# EAGLE design Keyboard (EAGLE 9.1.0)
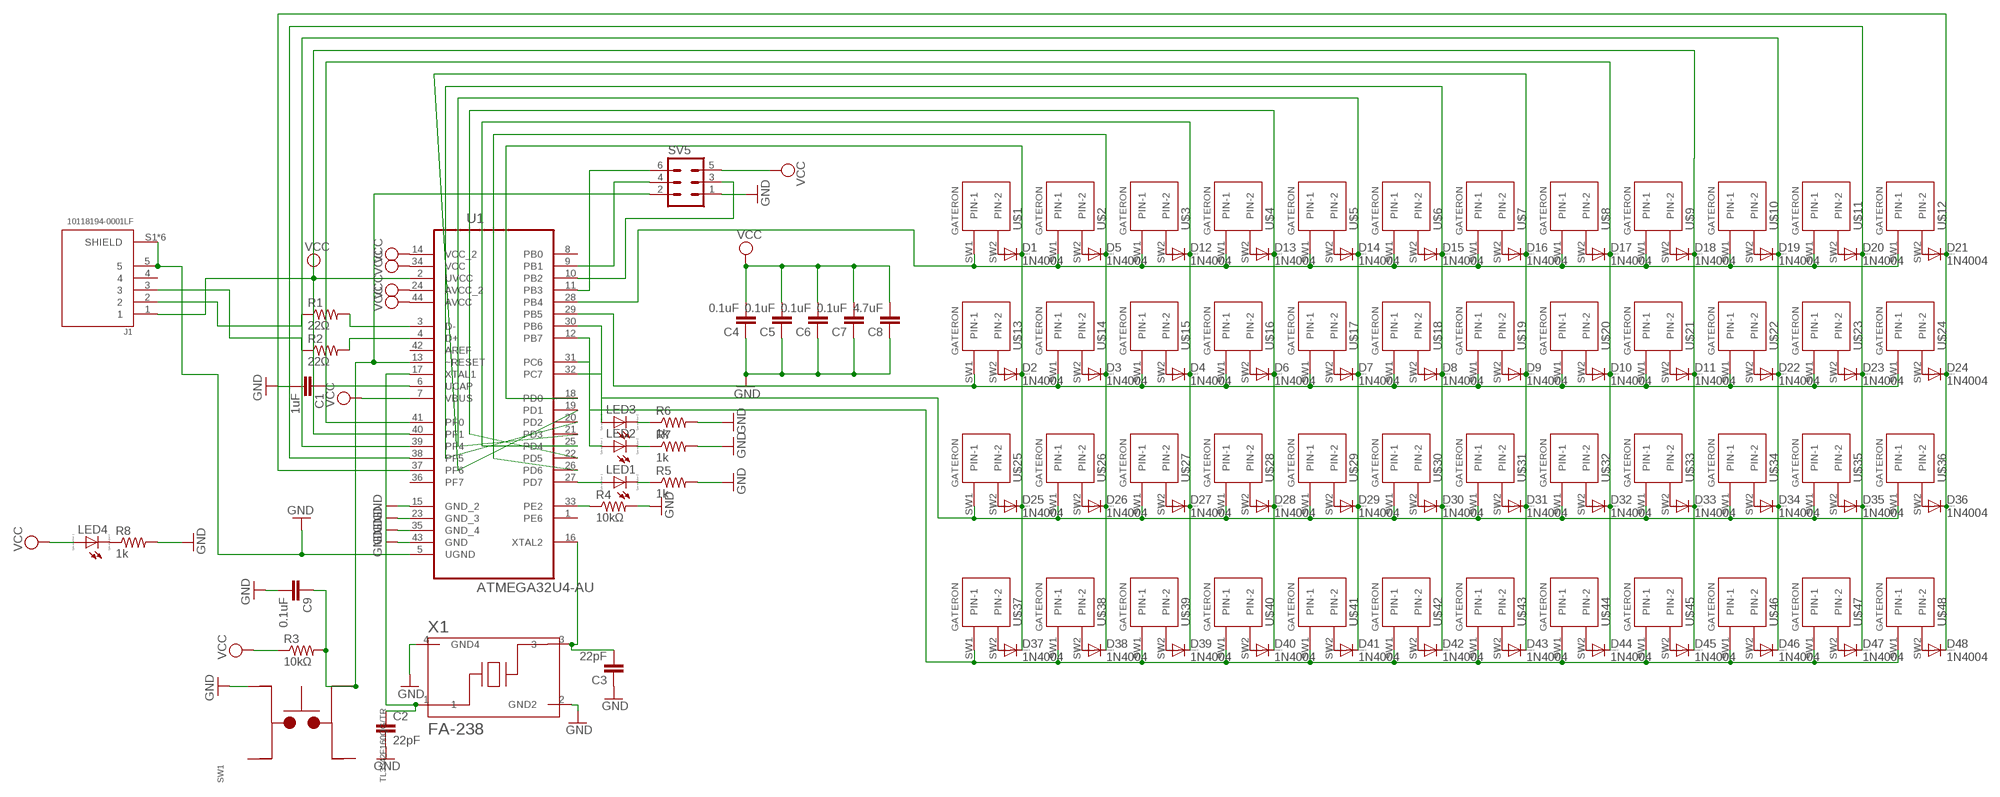
[diagram p0: schematic, sheet 1]

## Parts
C1  1uF  C-EUC0805  [C0805]
C2  22pF  C-EUC0805  [C0805]
C3  22pF  C-EUC0805  [C0805]
C4  0.1uF  C-EUC0805  [C0805]
C5  0.1uF  C-EUC0805  [C0805]
C6  0.1uF  C-EUC0805  [C0805]
C7  0.1uF  C-EUC0805  [C0805]
C8  4.7uF  C-EUC0805  [C0805]
C9  0.1uF  C-EUC0805  [C0805]
D1  1N4004  [DO41-10]
D2  1N4004  [DO41-10]
D3  1N4004  [DO41-10]
D4  1N4004  [DO41-10]
D5  1N4004  [DO41-10]
D6  1N4004  [DO41-10]
D7  1N4004  [DO41-10]
D8  1N4004  [DO41-10]
D9  1N4004  [DO41-10]
D10  1N4004  [DO41-10]
D11  1N4004  [DO41-10]
D12  1N4004  [DO41-10]
D13  1N4004  [DO41-10]
D14  1N4004  [DO41-10]
D15  1N4004  [DO41-10]
D16  1N4004  [DO41-10]
D17  1N4004  [DO41-10]
D18  1N4004  [DO41-10]
D19  1N4004  [DO41-10]
D20  1N4004  [DO41-10]
D21  1N4004  [DO41-10]
D22  1N4004  [DO41-10]
D23  1N4004  [DO41-10]
D24  1N4004  [DO41-10]
D25  1N4004  [DO41-10]
D26  1N4004  [DO41-10]
D27  1N4004  [DO41-10]
D28  1N4004  [DO41-10]
D29  1N4004  [DO41-10]
D30  1N4004  [DO41-10]
D31  1N4004  [DO41-10]
D32  1N4004  [DO41-10]
D33  1N4004  [DO41-10]
D34  1N4004  [DO41-10]
D35  1N4004  [DO41-10]
D36  1N4004  [DO41-10]
D37  1N4004  [DO41-10]
D38  1N4004  [DO41-10]
D39  1N4004  [DO41-10]
D40  1N4004  [DO41-10]
D41  1N4004  [DO41-10]
D42  1N4004  [DO41-10]
D43  1N4004  [DO41-10]
D44  1N4004  [DO41-10]
D45  1N4004  [DO41-10]
D46  1N4004  [DO41-10]
D47  1N4004  [DO41-10]
D48  1N4004  [DO41-10]
J1  10118194-0001LF  [AMPHENOL_10118194-0001LF]
LED1  LED_ELD260  [LED_LD260]
LED2  LED_ELD260  [LED_LD260]
LED3  LED_ELD260  [LED_LD260]
LED4  LED_ELD260  [LED_LD260]
R1  22Ω  R-US_R0805  [R0805]
R2  22Ω  R-US_R0805  [R0805]
R3  10kΩ  R-US_R0805  [R0805]
R4  10kΩ  R-US_R0805  [R0805]
R5  1k  R-US_R0805  [R0805]
R6  1k  R-US_R0805  [R0805]
R7  1k  R-US_R0805  [R0805]
R8  1k  R-US_R0805  [R0805]
SV5  MA03-2  [MA03-2]
SW1  TL3342F160QG/TR  [SW_TL3342F160QG/TR]
U1  ATMEGA32U4-AU  [QFP80P1200X1200X120-44N]
U$1  GATERON  [GATERON]
U$2  GATERON  [GATERON]
U$3  GATERON  [GATERON]
U$4  GATERON  [GATERON]
U$5  GATERON  [GATERON]
U$6  GATERON  [GATERON]
U$7  GATERON  [GATERON]
U$8  GATERON  [GATERON]
U$9  GATERON  [GATERON]
U$10  GATERON  [GATERON]
U$11  GATERON  [GATERON]
U$12  GATERON  [GATERON]
U$13  GATERON  [GATERON]
U$14  GATERON  [GATERON]
U$15  GATERON  [GATERON]
U$16  GATERON  [GATERON]
U$17  GATERON  [GATERON]
U$18  GATERON  [GATERON]
U$19  GATERON  [GATERON]
U$20  GATERON  [GATERON]
U$21  GATERON  [GATERON]
U$22  GATERON  [GATERON]
U$23  GATERON  [GATERON]
U$24  GATERON  [GATERON]
U$25  GATERON  [GATERON]
U$26  GATERON  [GATERON]
U$27  GATERON  [GATERON]
U$28  GATERON  [GATERON]
U$29  GATERON  [GATERON]
U$30  GATERON  [GATERON]
U$31  GATERON  [GATERON]
U$32  GATERON  [GATERON]
U$33  GATERON  [GATERON]
U$34  GATERON  [GATERON]
U$35  GATERON  [GATERON]
U$36  GATERON  [GATERON]
U$37  GATERON  [GATERON]
U$38  GATERON  [GATERON]
U$39  GATERON  [GATERON]
U$40  GATERON  [GATERON]
U$41  GATERON  [GATERON]
U$42  GATERON  [GATERON]
U$43  GATERON  [GATERON]
U$44  GATERON  [GATERON]
U$45  GATERON  [GATERON]
U$46  GATERON  [GATERON]
U$47  GATERON  [GATERON]
U$48  GATERON  [GATERON]
X1  FA-238  [OSCCC320X250X70-4N]

## Nets
GND: C1.2 C2.2 C3.1 C4.1 C5.1 C6.1 C7.1 C8.1 C9.2 J1.5 J1.S1(SHIELD) J1.S2(SHIELD) J1.S3(SHIELD) J1.S4(SHIELD) J1.S5(SHIELD) J1.S6(SHIELD) R4.2 R5.2 R6.2 R7.2 R8.2 SV5.1 SW1.4 U1.5(UGND) U1.15(GND_2) U1.23(GND_3) U1.35(GND_4) U1.43(GND) X1.2(GND2) X1.4(GND4)
N$1: R1.2 U1.3(D-)
N$2: J1.3 R2.1
N$3: J1.2 R1.1
N$4: C1.1 U1.6(UCAP)
N$5: R2.2 U1.4(D+)
N$6: U1.28(PB4) U$1.SW1(PIN-1) U$2.SW1(PIN-1) U$3.SW1(PIN-1) U$4.SW1(PIN-1) U$5.SW1(PIN-1) U$6.SW1(PIN-1) U$7.SW1(PIN-1) U$8.SW1(PIN-1) U$9.SW1(PIN-1) U$10.SW1(PIN-1) U$11.SW1(PIN-1) U$12.SW1(PIN-1)
N$7: C9.1 R3.2 SV5.2 SW1.2 U1.13(~RESET)
N$8: C2.1 U1.17(XTAL1) X1.1
N$9: R4.1 U1.33(PE2)
N$10: C3.2 U1.16(XTAL2) X1.3
N$11: LED1.A U1.27(PD7)
N$12: LED1.K(C) R5.1
N$13: U1.29(PB5) U$13.SW1(PIN-1) U$14.SW1(PIN-1) U$15.SW1(PIN-1) U$16.SW1(PIN-1) U$17.SW1(PIN-1) U$18.SW1(PIN-1) U$19.SW1(PIN-1) U$20.SW1(PIN-1) U$21.SW1(PIN-1) U$22.SW1(PIN-1) U$23.SW1(PIN-1) U$24.SW1(PIN-1)
N$14: D2.A U$13.SW2(PIN-2)
N$15: LED4.K(C) R8.1
N$16: SV5.6 U1.11(PB3)
N$17: SV5.4 U1.9(PB1)
N$18: SV5.3 U1.10(PB2)
N$19: D3.A U$14.SW2(PIN-2)
N$20: D1.A U$1.SW2(PIN-2)
N$21: D4.A U$15.SW2(PIN-2)
N$22: D6.A U$16.SW2(PIN-2)
N$23: D7.A U$17.SW2(PIN-2)
N$24: D5.A U$2.SW2(PIN-2)
N$25: D8.A U$18.SW2(PIN-2)
N$26: D9.A U$19.SW2(PIN-2)
N$27: D10.A U$20.SW2(PIN-2)
N$28: D11.A U$21.SW2(PIN-2)
N$29: D22.A U$22.SW2(PIN-2)
N$30: D23.A U$23.SW2(PIN-2)
N$31: D12.A U$3.SW2(PIN-2)
N$32: D13.A U$4.SW2(PIN-2)
N$33: D14.A U$5.SW2(PIN-2)
N$34: D15.A U$6.SW2(PIN-2)
N$35: D16.A U$7.SW2(PIN-2)
N$36: D17.A U$8.SW2(PIN-2)
N$37: D18.A U$9.SW2(PIN-2)
N$38: D19.A U$10.SW2(PIN-2)
N$39: D20.A U$11.SW2(PIN-2)
N$40: D21.A U$12.SW2(PIN-2)
N$41: D24.A U$24.SW2(PIN-2)
N$42: U1.30(PB6) U$25.SW1(PIN-1) U$26.SW1(PIN-1) U$27.SW1(PIN-1) U$28.SW1(PIN-1) U$29.SW1(PIN-1) U$30.SW1(PIN-1) U$31.SW1(PIN-1) U$32.SW1(PIN-1) U$33.SW1(PIN-1) U$34.SW1(PIN-1) U$35.SW1(PIN-1) U$36.SW1(PIN-1)
N$43: D25.A U$25.SW2(PIN-2)
N$44: D26.A U$26.SW2(PIN-2)
N$45: D27.A U$27.SW2(PIN-2)
N$46: D28.A U$28.SW2(PIN-2)
N$47: D29.A U$29.SW2(PIN-2)
N$48: D30.A U$30.SW2(PIN-2)
N$49: D31.A U$31.SW2(PIN-2)
N$50: D32.A U$32.SW2(PIN-2)
N$51: D33.A U$33.SW2(PIN-2)
N$52: D34.A U$34.SW2(PIN-2)
N$53: D35.A U$35.SW2(PIN-2)
N$54: D36.A U$36.SW2(PIN-2)
N$55: U1.12(PB7) U$37.SW1(PIN-1) U$38.SW1(PIN-1) U$39.SW1(PIN-1) U$40.SW1(PIN-1) U$41.SW1(PIN-1) U$42.SW1(PIN-1) U$43.SW1(PIN-1) U$44.SW1(PIN-1) U$45.SW1(PIN-1) U$46.SW1(PIN-1) U$47.SW1(PIN-1) U$48.SW1(PIN-1)
N$56: D37.A U$37.SW2(PIN-2)
N$57: D38.A U$38.SW2(PIN-2)
N$58: D39.A U$39.SW2(PIN-2)
N$59: D40.A U$40.SW2(PIN-2)
N$60: D41.A U$41.SW2(PIN-2)
N$61: D42.A U$42.SW2(PIN-2)
N$62: D43.A U$43.SW2(PIN-2)
N$63: D44.A U$44.SW2(PIN-2)
N$64: D45.A U$45.SW2(PIN-2)
N$65: D46.A U$46.SW2(PIN-2)
N$66: D47.A U$47.SW2(PIN-2)
N$67: D48.A U$48.SW2(PIN-2)
N$68: D1.C D2.C D25.C D37.C U1.18(PD0)
N$69: D3.C D5.C D26.C D38.C U1.26(PD6)
N$70: D4.C D12.C D27.C D39.C U1.25(PD4)
N$71: D6.C D13.C D28.C D40.C U1.22(PD5)
N$72: D7.C D14.C D29.C D41.C U1.21(PD3)
N$73: D8.C D15.C D30.C D42.C U1.20(PD2)
N$74: D9.C D16.C D31.C D43.C U1.19(PD1)
N$75: D10.C D17.C D32.C D44.C U1.41(PF0)
N$76: D11.C D18.C D33.C D45.C U1.40(PF1)
N$77: D19.C D22.C D34.C D46.C U1.39(PF4)
N$78: D20.C D23.C D35.C D47.C U1.38(PF5)
N$79: D21.C D24.C D36.C D48.C U1.37(PF6)
N$80: LED3.K(C) R6.1
N$81: LED2.K(C) R7.1
N$82: LED2.A U1.31(PC6)
N$83: LED3.A U1.32(PC7)
VCC: C4.2 C5.2 C6.2 C7.2 C8.2 J1.1 LED4.A R3.1 SV5.5 U1.2(UVCC) U1.7(VBUS) U1.14(VCC_2) U1.24(AVCC_2) U1.34(VCC) U1.44(AVCC)
Unconnected: J1.4 SW1.1 SW1.3 U1.1(PE6) U1.8(PB0) U1.36(PF7) U1.42(AREF)

## Library data of the parts
C1-C9 = rcl:C-EU: CAPACITOR, European symbol; SPICEPREFIX: C
D1-D48 = diode:1N4004: DIODE general purpose rectifier, 1 A
J1 = 10118194-0001LF:10118194-0001LF: Micro Usb, 2.0 Type b, Rcpt, Smt; AVAILABILITY: Unavailable; DESCRIPTION: Micro Usb, 2.0 Type b, Rcpt, Smt; MF: Amphenol ICC; MP: 10118194-0001LF; PACKAGE: None; PRICE: None
LED1-LED4 = eagle-ltspice:LED_E: LED Source: http://www.osram.convergy.de Source: www.luxeon.com Source: www.kingbright.com; SPICEMODEL: NONE; SPICEPREFIX: D; SPICETYPE: diode
R1-R8 = rcl:R-US_: RESISTOR, American symbol; SPICEPREFIX: R
SV5 = con-lstb:MA03-2: PIN HEADER; OC_FARNELL: unknown; OC_NEWARK: unknown
SW1 = TL3342F160QG_TR:TL3342F160QG/TR: TL3342 Series SPST 1.6 N Round Button Gull Wing Surface Mount Tactile Switch; DESCRIPTION: Switch Tactile Spst-No 0.05a 12v; DIGI-KEY_PART_NUMBER: EG2531CT-ND; DIGI-KEY_PURCHASE_URL: https://www.digikey.com/product-detail/en/e-switch/TL3342F160QG-TR/EG2531CT-ND/379004?utm_source=snapeda&utm_medium=aggregator&utm_campaign=symbol; MF: E-Switch; MP: TL3342F160QG/TR; PACKAGE: FakePackage u
U1 = ATMEGA32U4-AU:ATMEGA32U4-AU: 8-bit Microcontroller with ISP Flash and USB Controller; AVAILABILITY: Unavailable; DESCRIPTION: MCU 8-bit ATmega AVR RISC 32KB Flash 3.3V/5V 44-Pin TQFP; MF: Microchip; MP: ATMEGA32U4-AU; PACKAGE: TQFP-44 Microchip; PRICE: None
U$1-U$48 = gateron:GATERON: Gateron keyswitch
X1 = FA-238:FA-238: Crystal 24.0000mhz 18pf Smd; AVAILABILITY: Unavailable; MF: EPSON; MP: FA-238; PACKAGE: SMD-4 Epson; PRICE: None

## Board
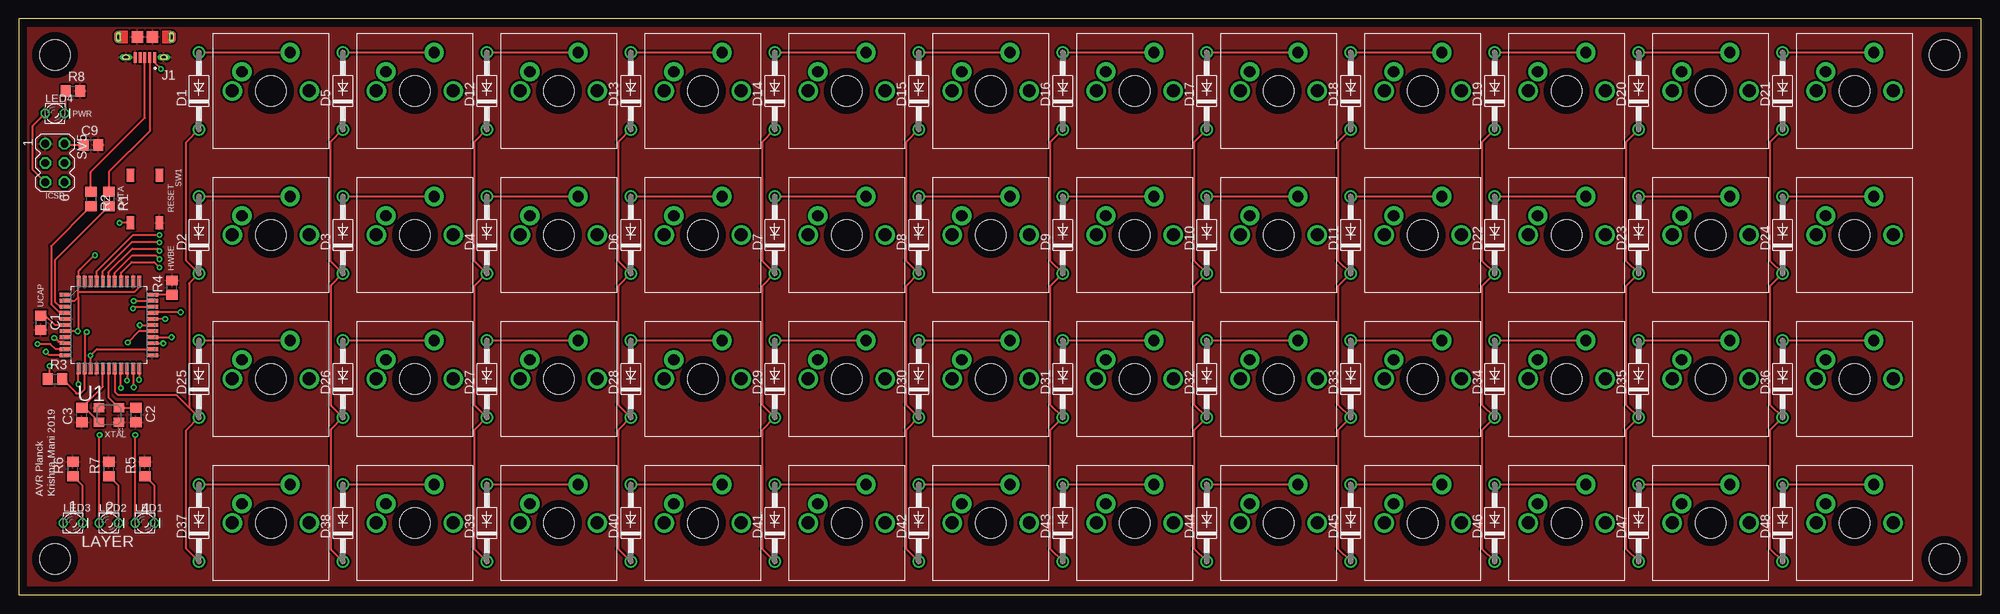
[diagram p1: board, top side]
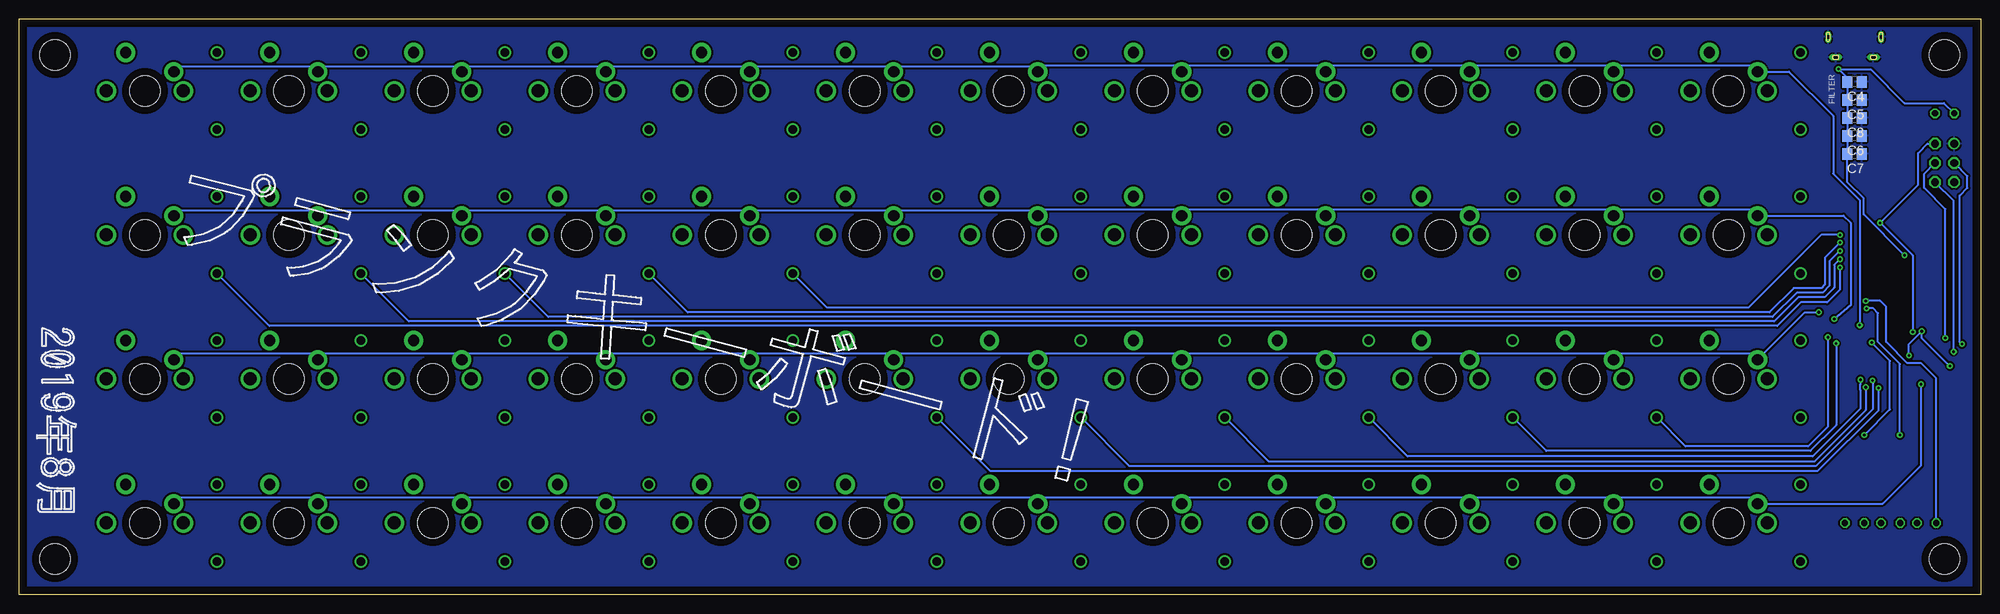
[diagram p2: board, bottom side, seen from below]

Size 258.88 x 76 mm. Coordinates in mm from the lower left corner, seen from the top.
Outline: 258.88,76 258.88,0 0,0 0,76 258.88,76
Copper layers (1*16): Top 0.035mm / dielectric 1.5mm / Bottom 0.035mm
Design rules "default *": minimum track width 6mil, minimum drill 0.35mm, track to track 10mil, track to pad 10mil, pad to pad 10mil, via to via 10mil, smd to smd 10mil, copper to edge 40mil, drill to drill 6mil, minimum pad ring 5mil, minimum via ring 8mil, stop-mask expansion 4mil, vias tented up to drill 0mil, thermal gap 10mil
Holes 4 mm at 4.75,71.25 4.75,4.75 254.12,71.25 254.12,4.75

### Footprints (pad centres in the part's own frame; a part is rotated, then mirrored left to right if it is on the bottom)
C0805 = smd 1.3 x 1.5: 1 -0.95,0; 2 0.95,0
DO41-10 = drill 1.118: A 5.08,0; C -5.08,0
AMPHENOL_10118194-0001LF = smd 0.4 x 1.35: 1 -1.3,2.7; 2 -0.65,2.7; 3 0,2.7; 4 0.65,2.7; 5 1.3,2.7 | drill 0.55 pad 0.65 long: S1 -2.5,2.7; S2 2.5,2.7 | drill 0.5 pad 0.775 long: S3 -3.5,0; S6 3.5,0 | smd 1.5 x 1.55: S4 -1,0; S5 1,0
LED_LD260 = drill 0.813 octagon: A -1.27,0; K 1.27,0
R0805 = smd 1.3 x 1.5: 1 -0.95,0; 2 0.95,0
MA03-2 = drill 1.016: 1 -2.54,-1.27 | drill 1.016 octagon: 2 -2.54,1.27; 3 0,-1.27; 4 0,1.27; 5 2.54,-1.27; 6 2.54,1.27
SW_TL3342F160QG/TR = smd 1.7 x 1: 1 -3.15,-1.9; 2 3.15,-1.9; 3 -3.15,1.9; 4 3.15,1.9
QFP80P1200X1200X120-44N = smd 1.473 x 0.508: 1 -5.74,3.988; 2 -5.74,3.2; 3 -5.74,2.388; 4 -5.74,1.6; 5 -5.74,0.787; 6 -5.74,0; 7 -5.74,-0.787; 8 -5.74,-1.6; 9 -5.74,-2.388; 10 -5.74,-3.2; 11 -5.74,-3.988; 23 5.74,-3.988; 24 5.74,-3.2; 25 5.74,-2.388; 26 5.74,-1.6; 27 5.74,-0.787; 28 5.74,0; 29 5.74,0.787; 30 5.74,1.6; 31 5.74,2.388; 32 5.74,3.2; 33 5.74,3.988 | smd 0.508 x 1.473: 12 -3.988,-5.74; 13 -3.2,-5.74; 14 -2.388,-5.74; 15 -1.6,-5.74; 16 -0.787,-5.74; 17 0,-5.74; 18 0.787,-5.74; 19 1.6,-5.74; 20 2.388,-5.74; 21 3.2,-5.74; 22 3.988,-5.74; 34 3.988,5.74; 35 3.2,5.74; 36 2.388,5.74; 37 1.6,5.74; 38 0.787,5.74; 39 0,5.74; 40 -0.787,5.74; 41 -1.6,5.74; 42 -2.388,5.74; 43 -3.2,5.74; 44 -3.988,5.74
GATERON = drill 1.714 pad 1.93: P$3 -5.08,0; P$4 5.08,0 | drill 1.5 pad 2.54: SW1 -3.81,2.54; SW2 2.54,5.08 | hole 4: 0,0
OSCCC320X250X70-4N = smd 1.4 x 1.2: 1 -1.3,-0.95; 2 1.3,-0.95; 3 1.3,0.95; 4 -1.3,0.95

### Placement (x,y rotation side)
C1  2.88,35.91 270 top
C2  15.44,23.75 270 top
C3  8.31,23.75 90 top
C4  16.62,67.69 180 bottom
C5  16.62,65.31 180 bottom
C6  16.62,60.56 180 bottom
C7  16.62,58.19 180 bottom
C8  16.62,62.94 180 bottom
C9  9.5,59.38 0 top
D1  23.75,66.5 90 top
D2  23.75,47.5 90 top
D3  42.75,47.5 90 top
D4  61.75,47.5 90 top
D5  42.75,66.5 90 top
D6  80.75,47.5 90 top
D7  99.75,47.5 90 top
D8  118.75,47.5 90 top
D9  137.75,47.5 90 top
D10  156.75,47.5 90 top
D11  175.75,47.5 90 top
D12  61.75,66.5 90 top
D13  80.75,66.5 90 top
D14  99.75,66.5 90 top
D15  118.75,66.5 90 top
D16  137.75,66.5 90 top
D17  156.75,66.5 90 top
D18  175.75,66.5 90 top
D19  194.75,66.5 90 top
D20  213.75,66.5 90 top
D21  232.75,66.5 90 top
D22  194.75,47.5 90 top
D23  213.75,47.5 90 top
D24  232.75,47.5 90 top
D25  23.75,28.5 90 top
D26  42.75,28.5 90 top
D27  61.75,28.5 90 top
D28  80.75,28.5 90 top
D29  99.75,28.5 90 top
D30  118.75,28.5 90 top
D31  137.75,28.5 90 top
D32  156.75,28.5 90 top
D33  175.75,28.5 90 top
D34  194.75,28.5 90 top
D35  213.75,28.5 90 top
D36  232.75,28.5 90 top
D37  23.75,9.5 90 top
D38  42.75,9.5 90 top
D39  61.75,9.5 90 top
D40  80.75,9.5 90 top
D41  99.75,9.5 90 top
D42  118.75,9.5 90 top
D43  137.75,9.5 90 top
D44  156.75,9.5 90 top
D45  175.75,9.5 90 top
D46  194.75,9.5 90 top
D47  213.75,9.5 90 top
D48  232.75,9.5 90 top
J1  16.62,73.62 180 top
LED1  16.62,9.5 0 top
LED2  11.88,9.5 0 top
LED3  7.12,9.5 0 top
LED4  4.75,63.54 0 top
R1  11.88,52.25 270 top
R2  9.5,52.25 270 top
R3  4.75,28.5 0 top
R4  20.2,40.55 90 top
R5  16.62,16.62 90 top
R6  7.12,16.62 90 top
R7  11.88,16.62 90 top
R8  7.12,66.5 0 top
SV5  4.75,57 270 top
SW1  16.62,52.25 270 top
U1  11.88,35.62 0 top
U$1  33.25,66.5 0 top
U$2  52.25,66.5 0 top
U$3  71.25,66.5 0 top
U$4  90.25,66.5 0 top
U$5  109.25,66.5 0 top
U$6  128.25,66.5 0 top
U$7  147.25,66.5 0 top
U$8  166.25,66.5 0 top
U$9  185.25,66.5 0 top
U$10  204.25,66.5 0 top
U$11  223.25,66.5 0 top
U$12  242.25,66.5 0 top
U$13  33.25,47.5 0 top
U$14  52.25,47.5 0 top
U$15  71.25,47.5 0 top
U$16  90.25,47.5 0 top
U$17  109.25,47.5 0 top
U$18  128.25,47.5 0 top
U$19  147.25,47.5 0 top
U$20  166.25,47.5 0 top
U$21  185.25,47.5 0 top
U$22  204.25,47.5 0 top
U$23  223.25,47.5 0 top
U$24  242.25,47.5 0 top
U$25  33.25,28.5 0 top
U$26  52.25,28.5 0 top
U$27  71.25,28.5 0 top
U$28  90.25,28.5 0 top
U$29  109.25,28.5 0 top
U$30  128.25,28.5 0 top
U$31  147.25,28.5 0 top
U$32  166.25,28.5 0 top
U$33  185.25,28.5 0 top
U$34  204.25,28.5 0 top
U$35  223.25,28.5 0 top
U$36  242.25,28.5 0 top
U$37  33.25,9.5 0 top
U$38  52.25,9.5 0 top
U$39  71.25,9.5 0 top
U$40  90.25,9.5 0 top
U$41  109.25,9.5 0 top
U$42  128.25,9.5 0 top
U$43  147.25,9.5 0 top
U$44  166.25,9.5 0 top
U$45  185.25,9.5 0 top
U$46  204.25,9.5 0 top
U$47  223.25,9.5 0 top
U$48  242.25,9.5 0 top
X1  11.88,23.75 180 top

### Tracks (layer width: path | path; a pad name or v marks a point on that pad's centre or on a via)
GND
  pour Top: -4.75,85.5 -4.75,-9.5 261.25,-9.5 261.25,85.5
  pour Bottom: -2.75,77.5 -2.75,-3.5 262.75,-3.5 262.75,77.5
N$1
  Top 0.254: R1.2 4.75,44.17 4.75,38.68 5.42,38.01 U1.3
N$2
  Top 0.254: R2.1 9.5,55.81 16.62,62.94 J1.3
N$3
  Top 0.254: J1.2 17.27,61.21 11.88,55.81 R1.1
N$4
  Top 0.254: C1.1 3.49,36.86 4.73,35.62 U1.6
N$5
  Top 0.254: R2.2 4.24,46.04 4.24,38.38 5.39,37.23 U1.4
N$6  (via drill 0.35)
  Top 0.254: U1.28 17.64,35.6 v15.95,35.6
  Bottom 0.254: U$12.SW1 237.78,69.7 220.1,69.7 U$11.SW1 218.78,69.7 201.1,69.7 U$10.SW1 199.78,69.7 182.1,69.7 U$9.SW1 180.78,69.7 163.1,69.7 U$8.SW1 161.78,69.7 144.1,69.7 U$7.SW1 142.78,69.7 125.1,69.7 U$6.SW1 123.68,69.8 106.2,69.8 U$5.SW1 104.68,69.8 87.2,69.8 U$4.SW1 85.68,69.8 68.2,69.8 U$3.SW1 66.68,69.8 49.2,69.8 U$2.SW1 47.68,69.8 30.2,69.8 U$1.SW1 25.29,69.04 19.45,63.2 19.45,55.6 15.95,52.1 v15.95,35.6
N$7  (via drill 0.35)
  Top 0.254: SV5.2 6.18,59.38 C9.1 | R3.2 7.55,26.65 7.55,26.6 8.15,26.6 8.68,27.12 U1.13 8.68,34.42 v8.95,34.7 | SW1.2 v13.25,49.1
  Bottom 0.254: SV5.2 7.01,59.54 8.25,58.3 8.25,54.1 v13.25,49.1 8.95,44.8 v8.95,34.7
N$8
  Top 0.254: C2.1 X1.1 11.88,26 U1.17
N$9
  Top 0.254: R4.1 U1.33
N$10
  Top 0.254: X1.3 8.68,24.7 C3.2 11.09,27.48 U1.16
N$11  (via drill 0.35)
  Top 0.254: LED1.A 15.36,21.2 15.35,21.2 v15.35,21.1 | v14.35,33.3 15.89,34.84 U1.27
  Bottom 0.254: v15.35,21.1 11.95,24.5 11.95,30.9 v14.35,33.3
N$12
  Top 0.254: LED1.K 17.89,14.41 R5.1
N$13  (via drill 0.35)
  Top 0.254: U1.29 17.67,36.44 v19.31,36.4
  Bottom 0.254: U$24.SW1 237.78,50.7 220.1,50.7 U$23.SW1 218.78,50.7 201.1,50.7 U$22.SW1 199.78,50.7 182.1,50.7 U$21.SW1 180.78,50.7 163.1,50.7 U$20.SW1 161.78,50.7 144.1,50.7 U$19.SW1 142.78,50.7 125.1,50.7 U$18.SW1 123.68,50.8 106.2,50.8 U$17.SW1 104.68,50.8 87.2,50.8 U$16.SW1 85.68,50.8 68.2,50.8 U$15.SW1 66.68,50.8 49.2,50.8 U$14.SW1 47.68,50.8 30.2,50.8 U$13.SW1 18.09,50.04 17.15,49.1 17.15,38.24 v19.31,36.4
N$14
  Top 0.254: D2.A U$13.SW2
N$15
  Top 0.254: LED4.K 6.18,63.69 R8.1
N$16  (via drill 0.35)
  Top 0.254: U1.11 4.01,31.64 v3.55,32.1
  Bottom 0.254: v3.55,32.1 3.55,51.99 SV5.6
N$17  (via drill 0.35)
  Top 0.254: U1.9 5.98,33.39 5.24,33.39 4.73,33.9 v4.65,33.9
  Bottom 0.254: v4.65,33.9 4.65,50.9 7.45,53.7 7.45,55.57 SV5.4
N$18  (via drill 0.35)
  Top 0.254: U1.10 4.82,32.42 4.15,33.1 v2.45,33.1
  Bottom 0.254: SV5.3 1.75,55.27 1.75,53.7 2.75,52.7 2.75,33.4 v2.45,33.1
N$19
  Top 0.254: D3.A U$14.SW2
N$20
  Top 0.254: D1.A U$1.SW2
N$21
  Top 0.254: D4.A U$15.SW2
N$22
  Top 0.254: D6.A U$16.SW2
N$23
  Top 0.254: D7.A U$17.SW2
N$24
  Top 0.254: D5.A U$2.SW2
N$25
  Top 0.254: D8.A U$18.SW2
N$26
  Top 0.254: D9.A U$19.SW2
N$27
  Top 0.254: D10.A U$20.SW2
N$28
  Top 0.254: D11.A U$21.SW2
N$29
  Top 0.254: D22.A U$22.SW2
N$30
  Top 0.254: D23.A U$23.SW2
N$31
  Top 0.254: D12.A U$3.SW2
N$32
  Top 0.254: D13.A U$4.SW2
N$33
  Top 0.254: D14.A U$5.SW2
N$34
  Top 0.254: D15.A U$6.SW2
N$35
  Top 0.254: D16.A U$7.SW2
N$36
  Top 0.254: D17.A U$8.SW2
N$37
  Top 0.254: D18.A U$9.SW2
N$38
  Top 0.254: D19.A U$10.SW2
N$39
  Top 0.254: D20.A U$11.SW2
N$40
  Top 0.254: D21.A U$12.SW2
N$41
  Top 0.254: D24.A U$24.SW2
N$42  (via drill 0.35)
  Top 0.254: v21.35,37.3 17.69,37.3 U1.30
  Bottom 0.254: U$36.SW1 237.68,31.8 220.2,31.8 U$35.SW1 218.68,31.8 201.2,31.8 U$34.SW1 199.68,31.8 182.2,31.8 U$33.SW1 180.68,31.8 163.2,31.8 U$32.SW1 161.68,31.8 144.2,31.8 U$31.SW1 142.68,31.8 125.2,31.8 U$30.SW1 123.68,31.8 106.2,31.8 U$29.SW1 104.68,31.8 87.2,31.8 U$28.SW1 85.68,31.8 68.2,31.8 U$27.SW1 66.68,31.8 49.2,31.8 U$26.SW1 47.68,31.8 30.2,31.8 U$25.SW1 23.18,37.3 v21.35,37.3
N$43
  Top 0.254: D25.A U$25.SW2
N$44
  Top 0.254: D26.A U$26.SW2
N$45
  Top 0.254: D27.A U$27.SW2
N$46
  Top 0.254: D28.A U$28.SW2
N$47
  Top 0.254: D29.A U$29.SW2
N$48
  Top 0.254: D30.A U$30.SW2
N$49
  Top 0.254: D31.A U$31.SW2
N$50
  Top 0.254: D32.A U$32.SW2
N$51
  Top 0.254: D33.A U$33.SW2
N$52
  Top 0.254: D34.A U$34.SW2
N$53
  Top 0.254: D35.A U$35.SW2
N$54
  Top 0.254: D36.A U$36.SW2
N$55  (via drill 0.35)
  Top 0.254: v7.85,27.8 7.85,29.85 U1.12
  Bottom 0.254: U$48.SW1 237.68,12.8 220.2,12.8 U$47.SW1 218.68,12.8 201.2,12.8 U$46.SW1 199.68,12.8 182.2,12.8 U$45.SW1 180.68,12.8 163.2,12.8 U$44.SW1 161.68,12.8 144.2,12.8 U$43.SW1 142.68,12.8 125.2,12.8 U$42.SW1 123.68,12.8 106.2,12.8 U$41.SW1 104.68,12.8 87.2,12.8 U$40.SW1 85.68,12.8 68.2,12.8 U$39.SW1 66.68,12.8 49.2,12.8 U$38.SW1 47.68,12.8 30.2,12.8 U$37.SW1 12.91,12.04 7.85,17.1 v7.85,27.8
N$56
  Top 0.254: D37.A U$37.SW2
N$57
  Top 0.254: D38.A U$38.SW2
N$58
  Top 0.254: D39.A U$39.SW2
N$59
  Top 0.254: D40.A U$40.SW2
N$60
  Top 0.254: D41.A U$41.SW2
N$61
  Top 0.254: D42.A U$42.SW2
N$62
  Top 0.254: D43.A U$43.SW2
N$63
  Top 0.254: D44.A U$44.SW2
N$64
  Top 0.254: D45.A U$45.SW2
N$65
  Top 0.254: D46.A U$46.SW2
N$66
  Top 0.254: D47.A U$47.SW2
N$67
  Top 0.254: D48.A U$48.SW2
N$68
  Top 0.254: D37.C 22.05,6.12 22.05,21.72 D25.C 22.45,24.72 | D1.C 22.05,59.72 22.05,44.12 D2.C 22.45,41.12 22.45,24.72 | U1.18 12.66,26.79 13.05,26.4 20.77,26.4 22.05,25.12 22.45,24.72
N$69  (via drill 0.35)
  Top 0.254: D5.C 41.05,59.72 41.05,44.12 D3.C 41.15,40.82 41.15,25.02 D26.C 41.15,21.82 41.15,6.02 D38.C | U1.26 20.12,34.02 v20.15,34
  Bottom 0.254: v20.15,34 20.15,22.2 22.75,19.6 38.93,19.6 D26.C
N$70  (via drill 0.35)
  Top 0.254: D12.C 60.05,59.72 60.05,44.12 D4.C 60.05,40.72 60.05,25.12 D27.C 60.05,21.72 60.05,6.12 D39.C | U1.25 19.01,33.24 v19.05,33.2
  Bottom 0.254: v19.05,33.2 19.05,22.4 22.45,19 57.33,19 D27.C
N$71  (via drill 0.35)
  Top 0.254: D13.C 79.05,59.72 79.05,44.12 D6.C 79.05,40.72 79.05,25.12 D28.C 79.05,21.72 79.05,6.12 D40.C | U1.22 15.86,28.41 v15.85,28.4
  Bottom 0.254: v15.85,28.4 15.85,27.77 15.91,27.71 15.91,27.09 15.85,27.03 15.85,24.6 22.15,18.3 75.63,18.3 D28.C
N$72  (via drill 0.35)
  Top 0.254: D14.C 98.05,59.72 98.05,44.12 D7.C 98.05,40.72 98.05,25.12 D29.C 98.05,21.72 98.05,6.12 D41.C | U1.21 15.07,27.48 v15.15,27.4
  Bottom 0.254: v15.15,27.4 15.15,24.4 21.95,17.6 93.93,17.6 D29.C
N$73  (via drill 0.35)
  Top 0.254: D15.C 117.05,59.72 117.05,44.12 D8.C 117.05,40.72 117.05,25.12 D30.C 117.05,21.72 117.05,6.12 D42.C | U1.20 14.26,28.31 v14.25,28.3
  Bottom 0.254: v14.25,28.3 14.25,24.5 21.75,17 112.33,17 D30.C
N$74  (via drill 0.35)
  Top 0.254: D16.C 136.05,59.72 136.05,44.12 D9.C 136.05,40.72 136.05,25.12 D31.C 136.05,21.72 136.05,6.12 D43.C | v13.45,27.3 13.45,29.86 U1.19
  Bottom 0.254: D31.C 130.73,16.4 21.45,16.4 13.45,24.4 v13.45,27.3
N$75  (via drill 0.35)
  Top 0.254: D17.C 155.05,59.72 155.05,44.12 D10.C 155.05,40.72 155.05,25.12 D32.C 155.05,21.72 155.05,6.12 D44.C | U1.41 10.27,42.73 15.05,47.5 v18.55,47.5
  Bottom 0.254: v18.55,47.5 21.05,47.5 30.65,37.9 152.23,37.9 D10.C
N$76  (via drill 0.35)
  Top 0.254: D18.C 174.05,59.72 174.05,44.12 D11.C 174.05,40.72 174.05,25.12 D33.C 174.05,21.72 174.05,6.12 D45.C | U1.40 11.09,42.74 14.95,46.6 18.55,46.6 v18.55,46.49
  Bottom 0.254: v18.55,46.49 20.55,44.49 20.55,41 21.05,40.5 24.65,40.5 27.85,37.3 170.63,37.3 D11.C
N$77  (via drill 0.35)
  Top 0.254: D19.C 193.05,59.72 193.05,44.12 D22.C 193.05,40.72 193.05,25.12 D34.C 193.05,21.72 193.05,6.12 D46.C | U1.39 11.88,42.62 14.95,45.7 18.25,45.7 v18.55,45.4
  Bottom 0.254: v18.55,45.4 19.95,44 19.95,40.8 20.85,39.9 24.25,39.9 27.45,36.7 189.03,36.7 D22.C
N$78  (via drill 0.35)
  Top 0.254: D20.C 212.05,59.72 212.05,44.12 D23.C 212.05,40.72 212.05,25.12 D35.C 212.05,21.72 212.05,6.12 D47.C | U1.38 12.66,42.51 14.95,44.8 18.05,44.8 v18.55,44.3
  Bottom 0.254: v18.55,44.3 19.31,43.54 19.31,40.54 20.55,39.3 24.05,39.3 27.25,36.1 207.43,36.1 D23.C
N$79  (via drill 0.35)
  Top 0.254: D21.C 231.05,59.72 231.05,44.12 D24.C 231.05,40.72 231.05,25.12 D36.C 231.05,21.72 231.05,6.12 D48.C | U1.37 13.48,42.52 14.85,43.9 17.85,43.9 v18.55,43.2
  Bottom 0.254: v18.55,43.2 18.55,40.3 20.25,38.6 23.75,38.6 26.85,35.5 225.83,35.5 D24.C
N$80
  Top 0.254: LED3.K 8.39,14.41 R6.1
N$81
  Top 0.254: LED2.K 13.14,14.41 R7.1
N$82  (via drill 0.35)
  Top 0.254: LED2.A 10.61,21.05 v10.65,21.1 | v15.05,37.79 15.27,38.01 U1.31
  Bottom 0.254: v10.65,21.1 10.65,30.5 13.55,33.4 13.55,37.2 14.15,37.8 v15.05,37.8 v15.05,37.79
N$83  (via drill 0.35)
  Top 0.254: v15.15,38.8 17.59,38.8 U1.32
  Bottom 0.254: LED3.A 5.86,28.61 7.85,30.6 9.65,30.6 12.45,33.4 12.45,38 13.25,38.8 v15.15,38.8
VCC  (via drill 0.35)
  Top 0.254: SV5.5 1.85,56.09 1.85,61.91 LED4.A | U1.7 7.71,34.84 | 7.71,34.84 v7.75,34.8 | R3.1 4.05,28.75 v4.05,30.2 | U1.14 9.49,31.56 v9.45,31.6 10.27,32.42 U1.24 | v10.04,44.81 9.96,44.81 8.11,42.96 7.89,42.74 7.85,42.7 7.85,41.33 | J1.1 17.93,70.22 v18.75,69.4 | U1.2 7.38,38.83 7.85,39.3 | 7.85,39.3 7.85,40 | 7.85,39.3 7.85,34.98 7.71,34.84 | 7.85,40 15.25,40 15.86,40.61 U1.34 | 7.85,40 7.85,41.33 | 7.85,41.33 U1.44
  Bottom 0.254: LED4.A 4.84,64.9 10.05,64.9 14.45,69.3 18.65,69.3 v18.75,69.4 17.57,68.22 C4.2 C5.2 C8.2 C6.2 C7.2 17.57,54.44 15.44,52.31 15.44,50.22 v10.04,44.81 | v4.05,30.2 7.75,33.9 v7.75,34.8 9.45,33.1 v9.45,31.6

### Text on the board
topSilk: PWR | ICSP | DATA | RESET | HWBE | UCAP | XTAL | AVR Planck / Krishna Mani 2019 | 1 | 2 | 4 | LAYER
botSilk: FILTER